# EAGLE design Jetson-Raspberry Pi Breakout RevA (EAGLE 9.6.2)
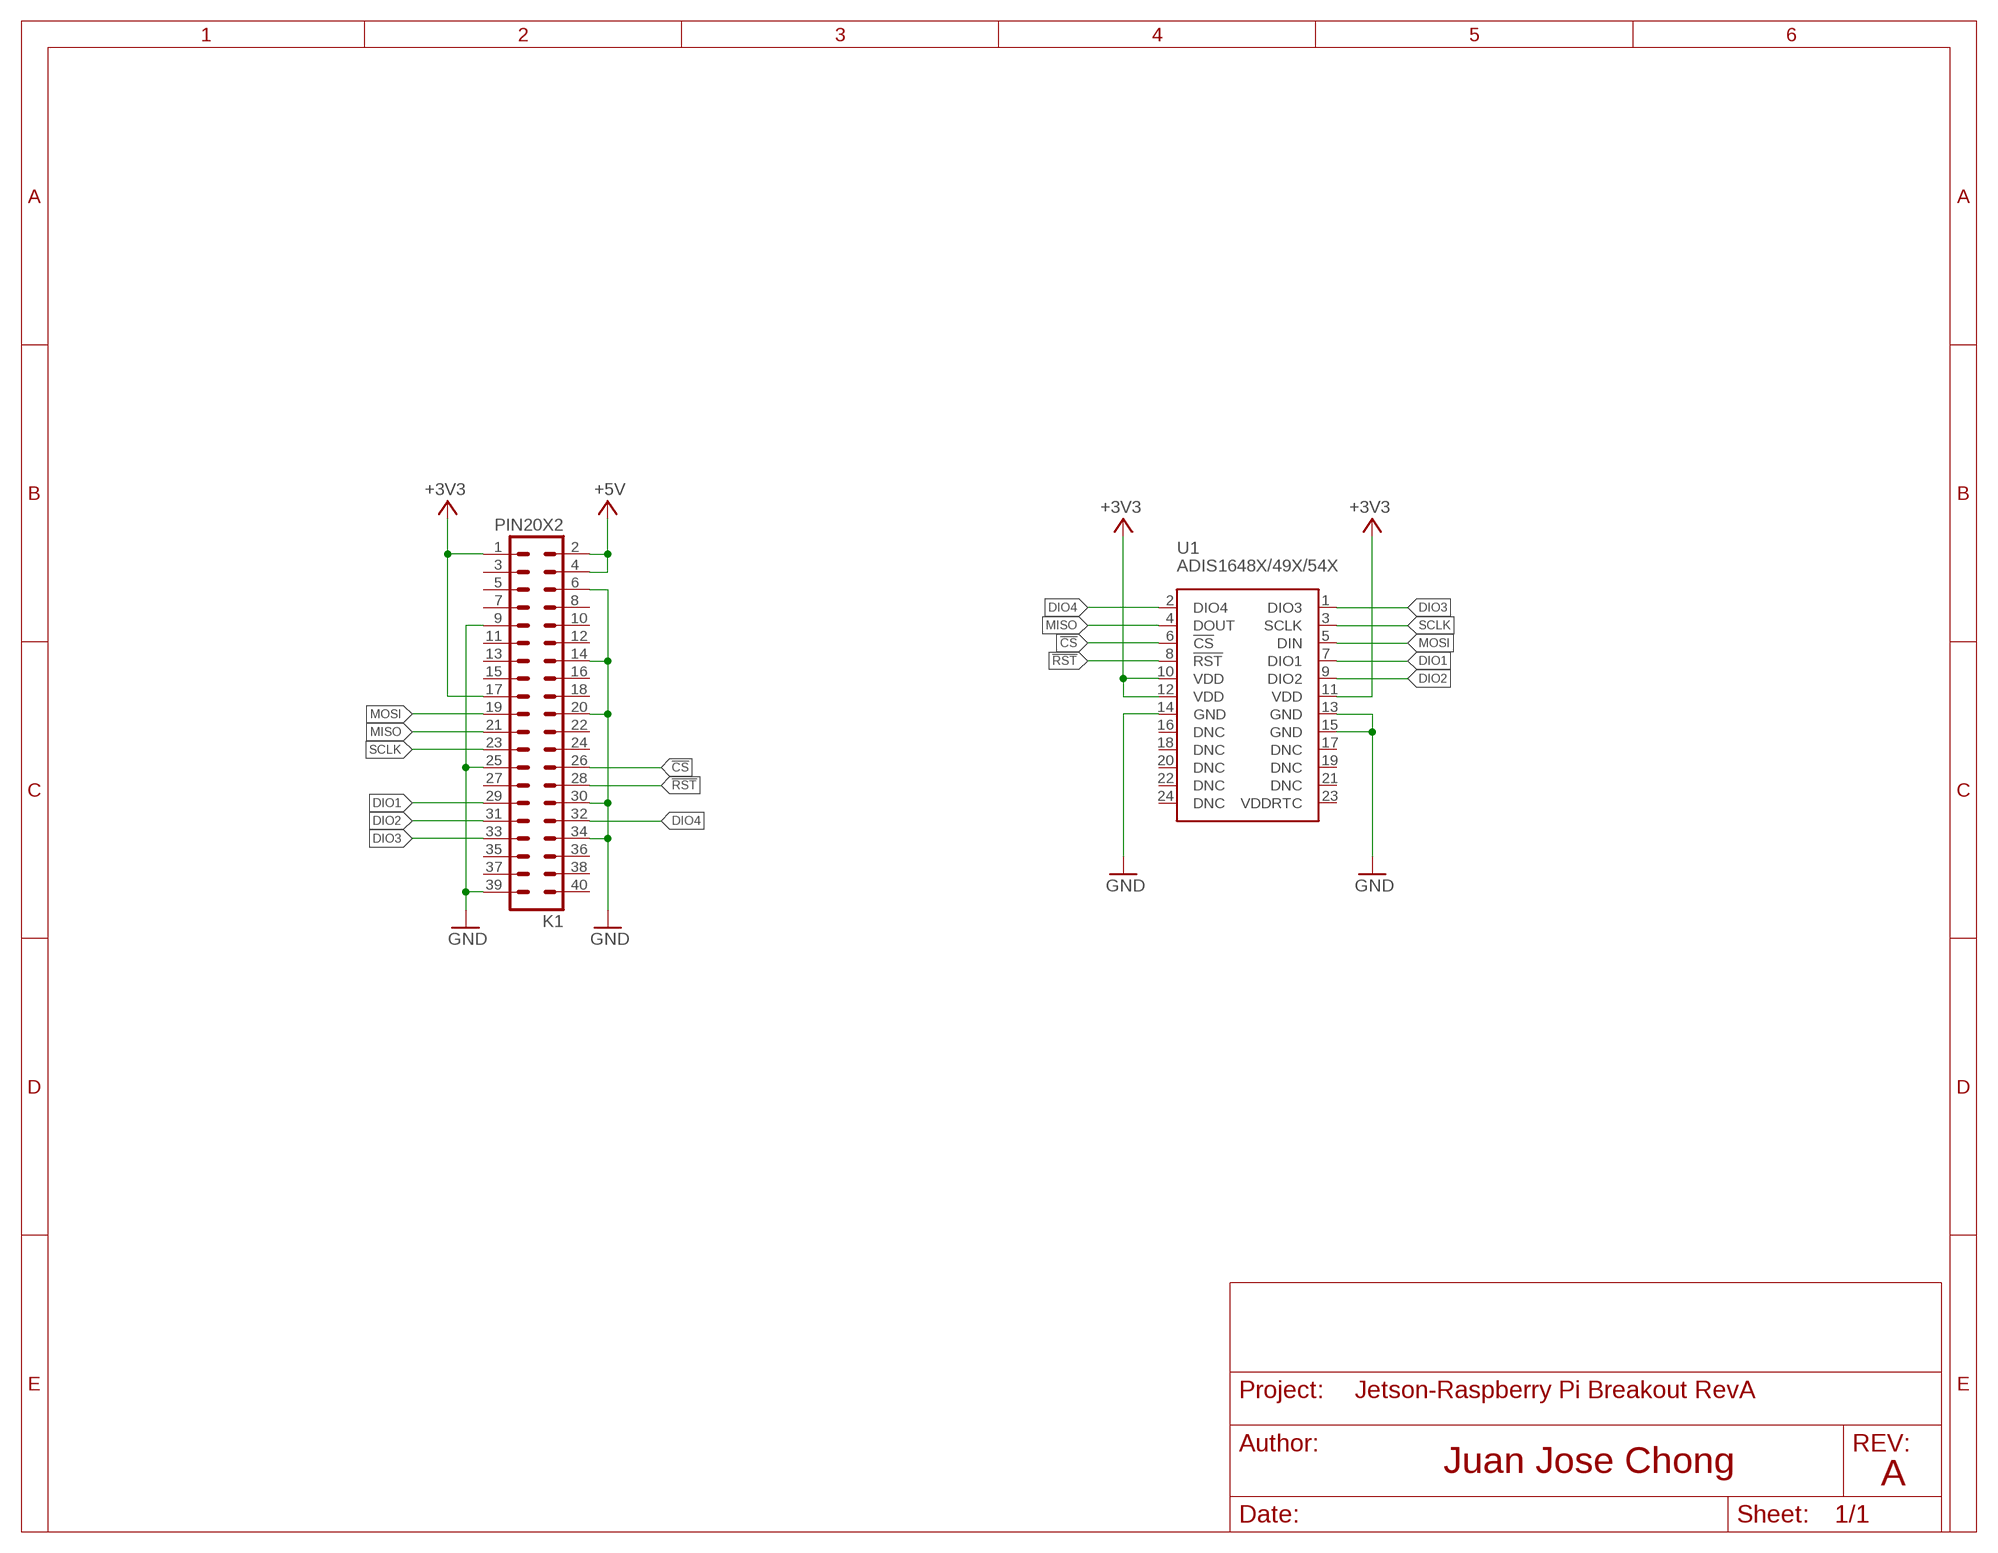
[diagram p0: schematic, sheet 1]

## Parts
K1  PIN20X2  [PIN_20X2]
U1  ADIS1648X/49X/54X  ADIS1648X/ADIS1649XTAPPED  [ADIS1648X-TAPPED]

## Nets
!CS: K1.26 U1.6(!CS)
!RST: K1.28 U1.8(!RST)
+3V3: K1.1 K1.17 U1.10(VDD) U1.11(VDD) U1.12(VDD)
+5V: K1.2 K1.4
DIO1: K1.29 U1.7(DIO1)
DIO2: K1.31 U1.9(DIO2)
DIO3: K1.33 U1.1(DIO3)
DIO4: K1.32 U1.2(DIO4)
GND: K1.6 K1.9 K1.14 K1.20 K1.25 K1.30 K1.34 K1.39 U1.13(GND) U1.14(GND) U1.15(GND)
MISO: K1.21 U1.4(DOUT)
MOSI: K1.19 U1.5(DIN)
SCLK: K1.23 U1.3(SCLK)
Unconnected: K1.3 K1.5 K1.7 K1.8 K1.10 K1.11 K1.12 K1.13 K1.15 K1.16 K1.18 K1.22 K1.24 K1.27 K1.35 K1.36 K1.37 K1.38 K1.40 U1.16(DNC) U1.17(DNC) U1.18(DNC) U1.19(DNC) U1.20(DNC) U1.21(DNC) U1.22(DNC) U1.23(VDDRTC) U1.24(DNC)

## Notes on the sheet
- A

## Library data of the parts
K1 = FLYFISH:PIN20X2
U1 = ADI_iSensor_Footprints:ADIS1648X/ADIS1649X: ADIS1649x Tactical Grade, Six Degrees of Freedom Inertial Sensor The ADIS1649x is a complete inertial system that includes a triaxis gyroscope and a triaxis accelerometer. Each inertial sensor in the ADIS1649x combines industry leading iMEMS® technology with signal conditioning that optimizes dynamic performance. The factory calibration characterizes each sensor for sensitivity, bias, alignment, and linear acceleration (gyroscope bias). As a result, each sensor has its own dynamic compensation formulas that provide accurate sensor measurements. The ADIS1649x provides a simple, cost effective method for integrating accurate, multiaxis inertial sensing into industrial systems, especially when compared with the complexity and investment associated with discrete designs. All necessary motion testing and calibration are part of the production process at the factory, greatly reducing system integration time. Tight orthogonal alignment simplifies inertial frame alignment in navigation systems. The serial peripheral interface (SPI) and register structure provide a simple interface for data collection and configuration control. The footprint and connector system of the ADIS1649x is compatible with previous generations such as the ADIS16375, ADIS16480, ADIS16485, ADIS16488A, and ADIS16490. The ADIS1649x is available in an aluminum package that is approximately 47 mm × 44 mm × 14 mm and includes a standard connector interface. You are welcome to use this library for commercial purposes. For attribution, I ask that you reach out by sending me a link to the product being sold. My e-mail address is: juan@highcurrent.io

## Board
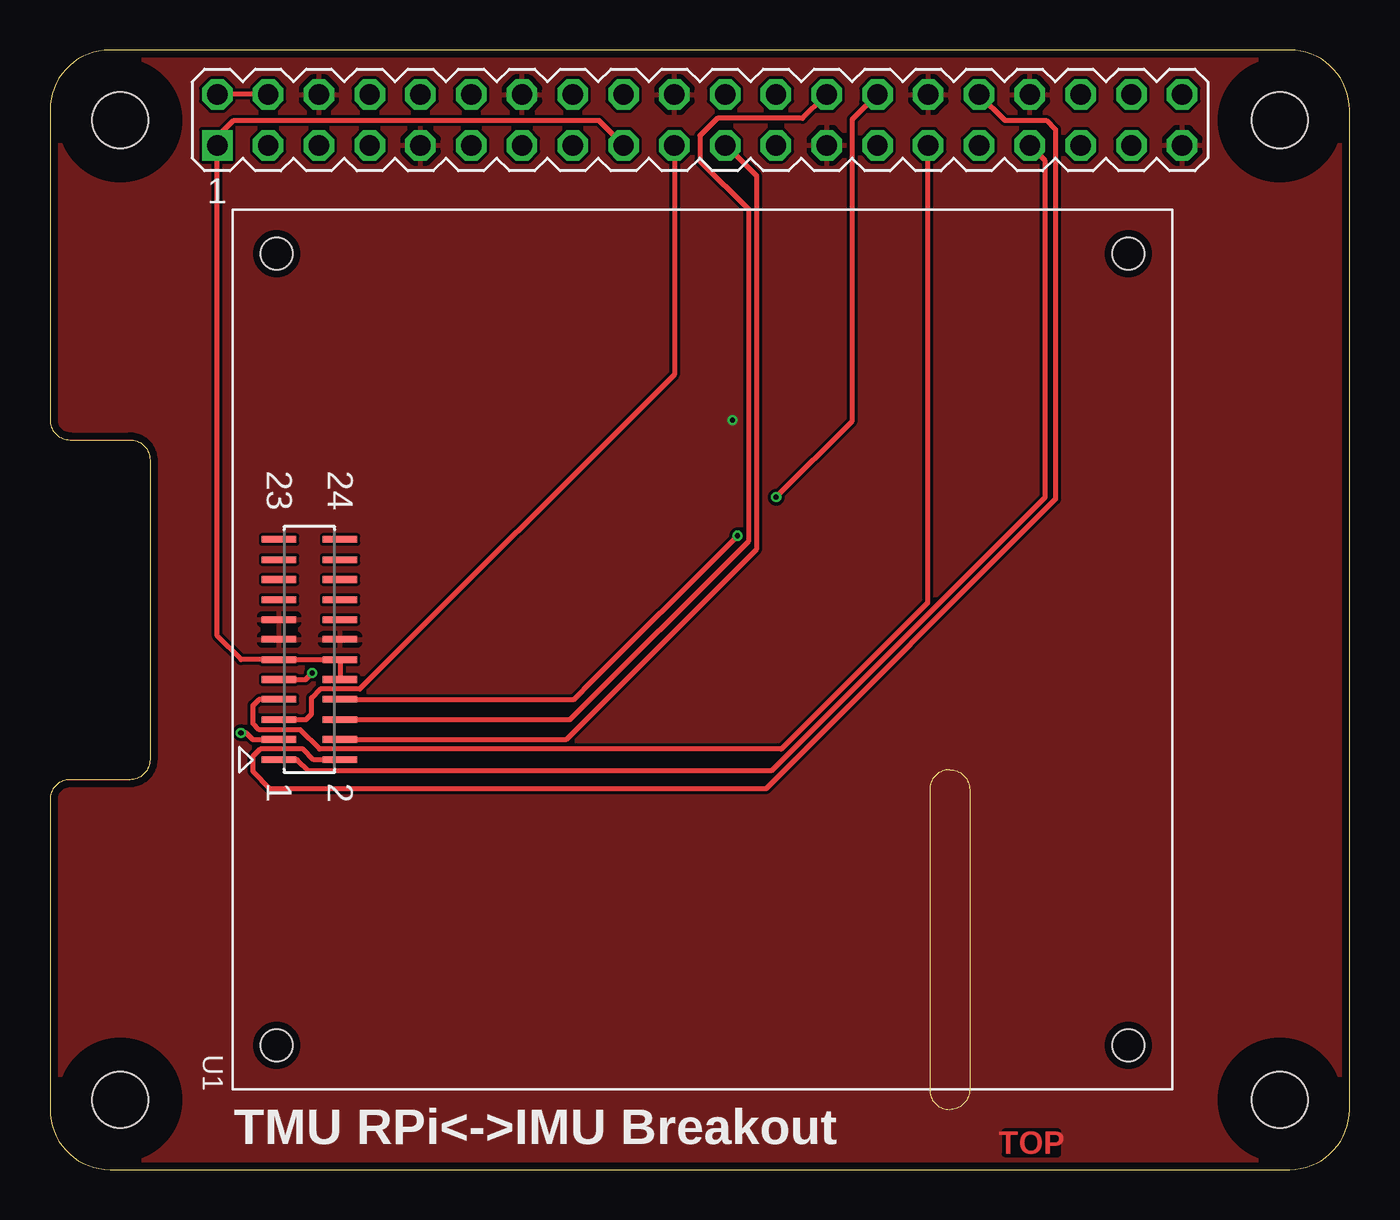
[diagram p1: board, top side]
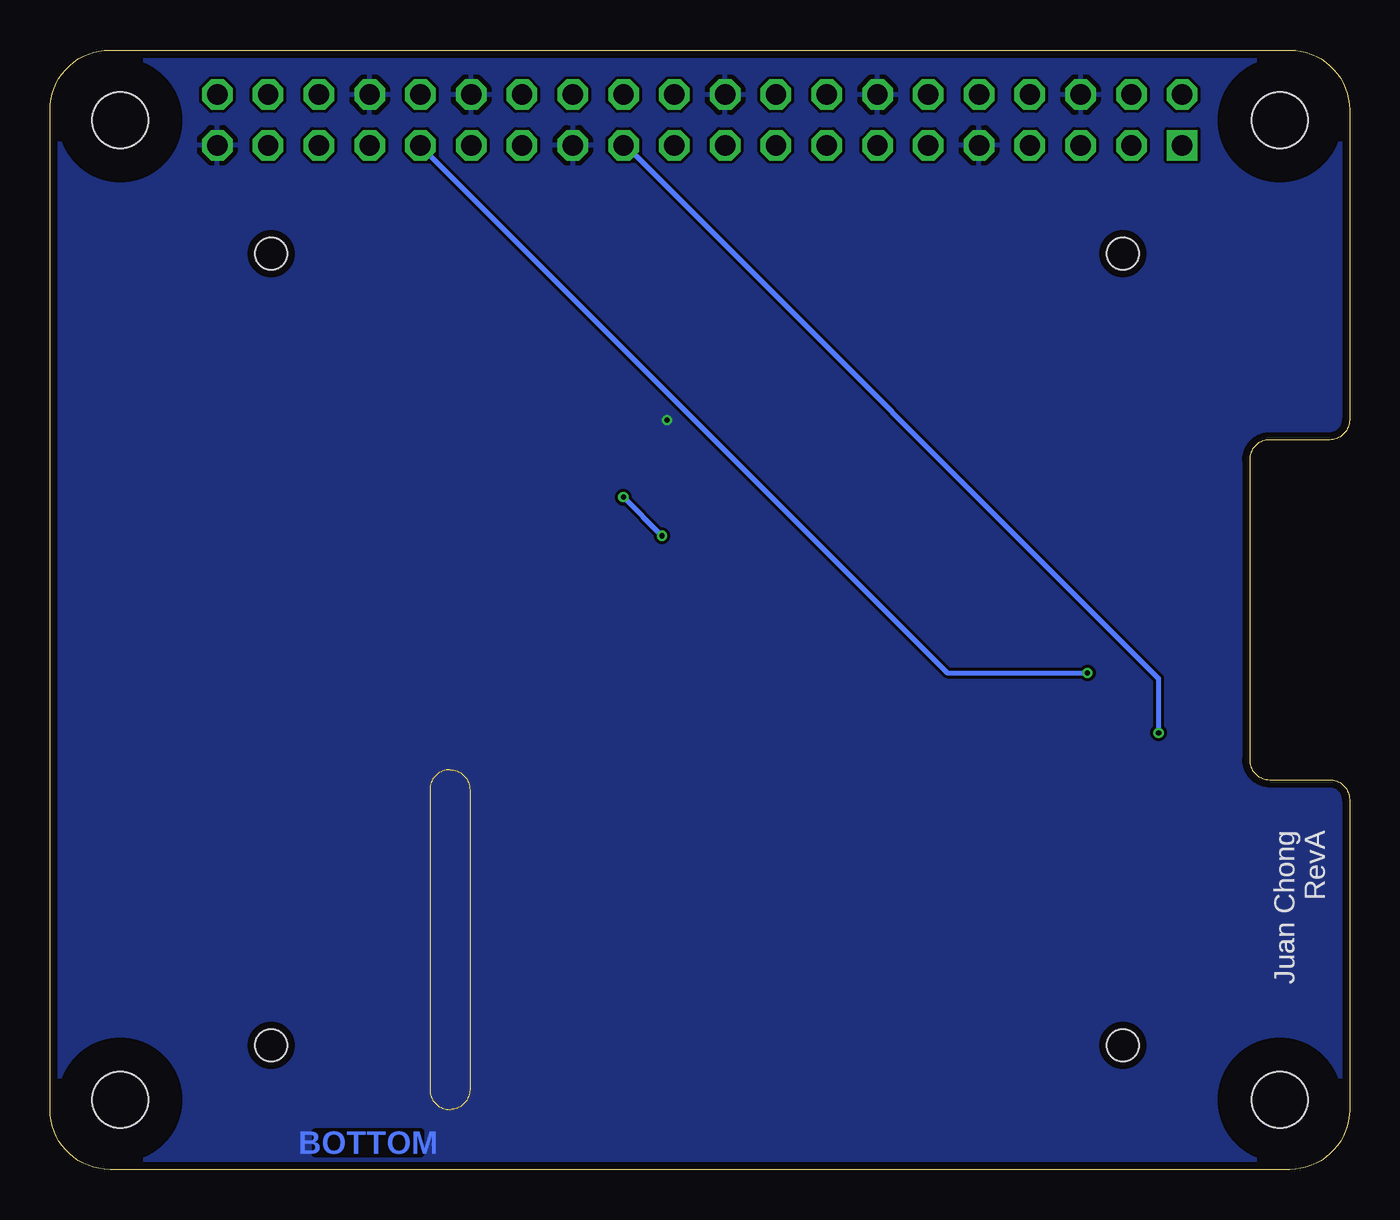
[diagram p2: board, bottom side, seen from below]

Size 65 x 56 mm. Coordinates in mm from the lower left corner, seen from the top.
Outline: 0,3 arc90 3,0 62,0 arc90 65,3 65,53 arc90 62,56 3,56 arc90 0,53 0,37.5 arc90 1,36.5 4,36.5 arc-90 5,35.5 5,20.5 arc-90 4,19.5 1,19.5 arc90 0,18.5 0,3
Copper layers (1*16): Top 0.035559375mm / dielectric 1.6mm / Bottom 0.035559375mm
Design rules "oshpark-2layer *": minimum track width 6mil, minimum drill 10mil, track to track 6mil, track to pad 6mil, pad to pad 6mil, via to via 6mil, smd to smd 6mil, copper to edge 15mil, drill to drill 6mil, minimum pad ring 5mil, minimum via ring 5mil, stop-mask expansion 2.5mil, vias tented up to drill 12mil, thermal gap 10mil
Holes 2.8 mm at 3.5,3.5 3.5,52.5 61.5,52.5 61.5,3.5
tRestrict: area 1.9,51 to 5,54; area 60,51 to 63,54; area 60,1.9 to 63,5; area 1.9,1.9 to 5,5
bRestrict: area 1.9,1.9 to 5,5; area 1.9,51 to 5,54; area 60,1.9 to 63,5; area 60,51 to 63,54
Milling: 6 lines

### Footprints (pad centres in the part's own frame; a part is rotated, then mirrored left to right if it is on the bottom)
PIN_20X2 = drill 1.016 square: 1 -24.13,-1.27 | drill 1.016 octagon: 2 -24.13,1.27; 3 -21.59,-1.27; 4 -21.59,1.27; 5 -19.05,-1.27; 6 -19.05,1.27; 7 -16.51,-1.27; 8 -16.51,1.27; 9 -13.97,-1.27; 10 -13.97,1.27; 11 -11.43,-1.27; 12 -11.43,1.27; 13 -8.89,-1.27; 14 -8.89,1.27; 15 -6.35,-1.27; 16 -6.35,1.27; 17 -3.81,-1.27; 18 -3.81,1.27; 19 -1.27,-1.27; 20 -1.27,1.27; 21 1.27,-1.27; 22 1.27,1.27; 23 3.81,-1.27; 24 3.81,1.27; 25 6.35,-1.27; 26 6.35,1.27; 27 8.89,-1.27; 28 8.89,1.27; 29 11.43,-1.27; 30 11.43,1.27; 31 13.97,-1.27; 32 13.97,1.27; 33 16.51,-1.27; 34 16.51,1.27; 35 19.05,-1.27; 36 19.05,1.27; 37 21.59,-1.27; 38 21.59,1.27; 39 24.13,-1.27; 40 24.13,1.27
ADIS1648X-TAPPED = smd 0.33 x 1.727: 1 5.512,-1.524; 2 5.512,1.524; 3 4.496,-1.524; 4 4.496,1.524; 5 3.505,-1.524; 6 3.505,1.524; 7 2.489,-1.524; 8 2.489,1.524; 9 1.499,-1.524; 10 1.499,1.524; 11 0.508,-1.524; 12 0.508,1.524; 13 -0.508,-1.524; 14 -0.508,1.524; 15 -1.499,-1.524; 16 -1.499,1.524; 17 -2.489,-1.524; 18 -2.489,1.524; 19 -3.505,-1.524; 20 -3.505,1.524; 21 -4.496,-1.524; 22 -4.496,1.524; 23 -5.512,-1.524; 24 -5.512,1.524 | hole 1.6: -19.8,-1.642; 19.8,-1.642; 19.8,40.958; -19.8,40.958

### Placement (x,y rotation side)
K1  32.5,52.5 0 top
U1  12.98,26.01 270 top

### Tracks (layer width: path | path; a pad name or v marks a point on that pad's centre or on a via)
!CS
  Top 0.254: K1.26 38.71,53.65 37.64,52.58 33.38,52.58 32.51,51.71 32.51,50.44 34.95,48.01 34.95,31.45 26.01,22.5 U1.6
!RST  (via drill 0.25)
  Top 0.254: v34.39,31.7 26.7,24 26.63,23.94 26.21,23.52 U1.8 | v36.32,33.63 40.13,37.44 40.13,52.53 41.38,53.77 K1.28
  Bottom 0.254: v34.39,31.7 v36.32,33.63
+3V3
  Top 0.254: U1.10 U1.12 U1.11 9.55,25.5 8.37,26.68 K1.1 8.37,51.65 9.2,52.48 27.44,52.48 K1.17
+5V
  Top 0.254: K1.2 8.38,53.8 10.82,53.8 K1.4
DIO1
  Top 0.254: U1.7 10.46,23.52 10.16,23.22 10.16,22.3 10.46,22 12.52,22 13.49,21.03 36.58,21.03 43.89,28.35 43.89,51.21 K1.29
DIO2  (via drill 0.25)
  Top 0.254: U1.9 12.78,24.51 v13.11,24.84
  Bottom 0.254: v13.11,24.84 20.12,24.84 46.48,51.21 K1.31
DIO3
  Top 0.254: U1.1 12.37,20.5 12.9,19.96 36.12,19.96 49.78,33.63 49.78,50.46 K1.33
DIO4
  Top 0.254: K1.32 47.76,52.48 49.84,52.48 50.29,52.02 50.29,33.53 35.81,19.05 11.02,19.05 10.16,19.91 10.16,20.68 10.52,21.03 12.66,21.03 13.2,20.5 U1.2
GND  (via drill 0.25)
  other vias: 34.14,37.49
  pour Bottom: 0,3 arc90 3,0 62,0 arc90 65,3 65,53 arc90 62,56 3,56 arc90 0,53 0,37.5 arc90 1,36.5 4,36.5 arc-90 5,35.5 5,20.5 arc-90 4,19.5 1,19.5 arc90 0,18.5
  pour Top: 0,3 arc90 3,0 62,0 arc90 65,3 65,53 arc90 62,56 3,56 arc90 0,53 0,37.5 arc90 1,36.5 4,36.5 arc-90 5,35.5 5,20.5 arc-90 4,19.5 1,19.5 arc90 0,18.5
MISO
  Top 0.254: K1.21 33.83,51.21 35.36,49.68 35.36,31.04 25.83,21.51 U1.4
MOSI
  Top 0.254: U1.5 12.8,22.5 13.08,22.78 13.08,23.59 13.51,24.02 15.49,24.02 31.23,39.76 K1.19
SCLK  (via drill 0.25)
  Top 0.254: v9.55,21.84 9.8,21.84 10.16,21.49 11.49,21.49 U1.3
  Bottom 0.254: K1.23 36.21,51.23 9.55,24.57 v9.55,21.84

### Text on the board
Top: TOP
Bottom: BOTTOM
tNames: TMU RPi<->IMU Breakout
bNames: RevA | Juan Chong